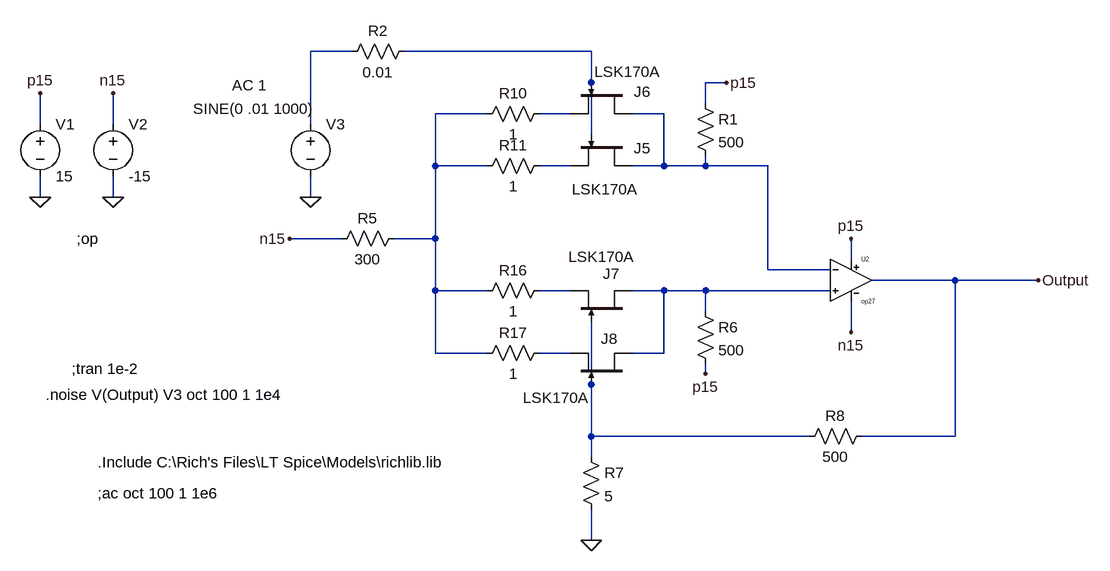
[diagram p0: schematic low_noise_4_fet_preamp.asc]
low_noise_4_fet_preamp.asc, the LTspice schematic file:
Version 4
SHEET 1 1400 772
WIRE -960 -224 -1024 -224
WIRE -592 -224 -880 -224
WIRE -592 -176 -592 -224
WIRE -384 -176 -416 -176
WIRE -416 -144 -416 -176
WIRE -752 -128 -832 -128
WIRE -624 -128 -672 -128
WIRE -480 -128 -528 -128
WIRE -1440 -112 -1440 -160
WIRE -1328 -112 -1328 -160
WIRE -1024 -112 -1024 -224
WIRE -592 -96 -592 -176
WIRE -832 -48 -832 -128
WIRE -752 -48 -832 -48
WIRE -624 -48 -672 -48
WIRE -480 -48 -480 -128
WIRE -480 -48 -528 -48
WIRE -416 -48 -416 -64
WIRE -416 -48 -480 -48
WIRE -320 -48 -416 -48
WIRE -1440 0 -1440 -32
WIRE -1328 0 -1328 -32
WIRE -1024 0 -1024 -32
WIRE -976 64 -1056 64
WIRE -832 64 -832 -48
WIRE -832 64 -896 64
WIRE -192 96 -192 64
WIRE -320 112 -320 -48
WIRE -224 112 -320 112
WIRE -32 128 -160 128
WIRE 96 128 -32 128
WIRE -832 144 -832 64
WIRE -752 144 -832 144
WIRE -624 144 -672 144
WIRE -480 144 -528 144
WIRE -416 144 -480 144
WIRE -224 144 -416 144
WIRE -416 176 -416 144
WIRE -192 208 -192 160
WIRE -832 240 -832 144
WIRE -752 240 -832 240
WIRE -624 240 -672 240
WIRE -480 240 -480 144
WIRE -480 240 -528 240
WIRE -416 272 -416 256
WIRE -592 288 -592 192
WIRE -592 368 -592 288
WIRE -256 368 -592 368
WIRE -32 368 -32 128
WIRE -32 368 -176 368
WIRE -592 400 -592 368
WIRE -592 528 -592 480
FLAG -1440 0 0
FLAG -1328 0 0
FLAG -1440 -160 p15
FLAG -1328 -160 n15
FLAG 96 128 Output
FLAG -192 64 p15
FLAG -192 208 n15
FLAG -1024 0 0
FLAG -1056 64 n15
FLAG -592 528 0
FLAG -384 -176 p15
FLAG -416 272 p15
SYMBOL voltage -1440 -128 R0
WINDOW 123 0 0 Left 2
WINDOW 39 0 0 Left 2
SYMATTR InstName V1
SYMATTR Value 15
SYMBOL voltage -1328 -128 R0
WINDOW 123 0 0 Left 2
WINDOW 39 0 0 Left 2
SYMATTR InstName V2
SYMATTR Value -15
SYMBOL voltage -1024 -128 R0
WINDOW 123 -121 -44 Left 2
WINDOW 39 0 0 Left 2
WINDOW 3 -181 -8 Left 2
SYMATTR Value2 AC 1
SYMATTR Value SINE(0 .01 1000)
SYMATTR InstName V3
SYMBOL res -432 -160 R0
SYMATTR InstName R1
SYMATTR Value 500
SYMBOL res -864 -240 R90
WINDOW 0 0 56 VBottom 2
WINDOW 3 32 56 VTop 2
SYMATTR InstName R2
SYMATTR Value 0.01
SYMBOL res -992 80 R270
WINDOW 0 32 56 VTop 2
WINDOW 3 0 56 VBottom 2
SYMATTR InstName R5
SYMATTR Value 300
SYMBOL res -432 160 R0
SYMATTR InstName R6
SYMATTR Value 500
SYMBOL res -608 384 R0
SYMATTR InstName R7
SYMATTR Value 5
SYMBOL res -160 352 R90
WINDOW 0 0 56 VBottom 2
WINDOW 3 32 56 VTop 2
SYMATTR InstName R8
SYMATTR Value 500
SYMBOL njf -528 -96 R90
WINDOW 0 21 -27 VRight 2
WINDOW 3 84 -8 VRight 2
SYMATTR InstName J5
SYMATTR Value LSK170A
SYMBOL njf -528 -176 R90
WINDOW 0 14 -27 VRight 2
WINDOW 3 -17 -42 VRight 2
SYMATTR InstName J6
SYMATTR Value LSK170A
SYMBOL njf -528 192 M270
WINDOW 0 74 46 VLeft 2
WINDOW 3 -117 169 VLeft 2
SYMATTR InstName J7
SYMATTR Value LSK170A
SYMBOL njf -528 288 M270
WINDOW 0 70 49 VLeft 2
WINDOW 3 196 99 VLeft 2
SYMATTR InstName J8
SYMATTR Value LSK170A
SYMBOL res -768 -112 R270
WINDOW 0 32 56 VTop 2
WINDOW 3 0 56 VBottom 2
SYMATTR InstName R10
SYMATTR Value 1
SYMBOL res -768 -32 R270
WINDOW 0 32 56 VTop 2
WINDOW 3 0 56 VBottom 2
SYMATTR InstName R11
SYMATTR Value 1
SYMBOL res -768 160 R270
WINDOW 0 32 56 VTop 2
WINDOW 3 0 56 VBottom 2
SYMATTR InstName R16
SYMATTR Value 1
SYMBOL res -768 256 R270
WINDOW 0 32 56 VTop 2
WINDOW 3 0 56 VBottom 2
SYMATTR InstName R17
SYMATTR Value 1
SYMBOL Rich_parts\\op27_my -192 64 R0
SYMATTR InstName U2
TEXT -1352 408 Left 2 !.Include C:\\Rich's Files\\LT Spice\\Models\\richlib.lib
TEXT -1352 456 Left 2 !;ac oct 100 1 1e6
TEXT -1432 304 Left 2 !.noise V(Output) V3 oct 100 1 1e4
TEXT -1384 64 Left 2 !;op
TEXT -1392 264 Left 2 !;tran 1e-2

The netlist it stands for:
* low_noise_4_fet_preamp.asc
V1 p15 0 15
V2 n15 0 -15
V3 N001 0 SINE(0 .01 1000) AC 1
R1 p15 N005 500
R2 N002 N001 0.01
R5 n15 N003 300
R6 N008 p15 500
R7 N010 0 5
R8 Output N010 500
J5 N005 N002 N006 LSK170A
J6 N005 N002 N004 LSK170A
J7 N008 N010 N007 LSK170A
J8 N008 N010 N009 LSK170A
R10 N003 N004 1
R11 N003 N006 1
R16 N003 N007 1
R17 N003 N009 1
XU2 N008 N005 p15 n15 Output op27  ; pins In+ In- V+ V- OUT
.model NJF NJF
.model PJF PJF
.lib standard.jft
.Include C:\Rich's Files\LT Spice\Models\richlib.lib
;ac oct 100 1 1e6
.noise V(Output) V3 oct 100 1 1e4
;op
;tran 1e-2
.backanno
.end